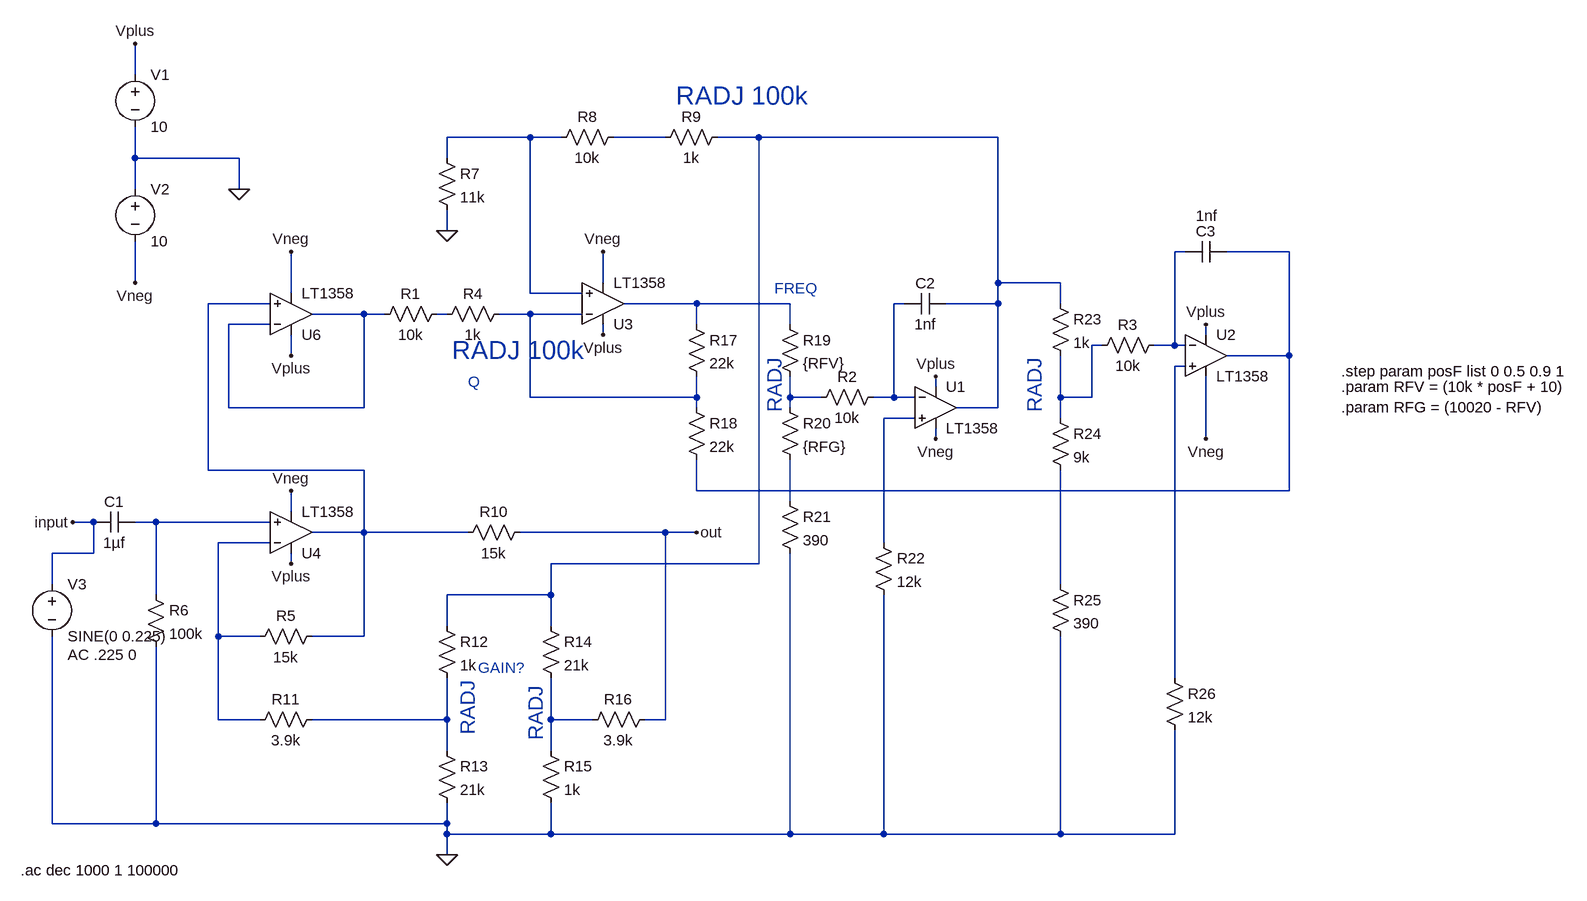
[diagram p0: schematic param_eq.asc]
param_eq.asc, the LTspice schematic file:
Version 4.1
SHEET 1 1232 680
WIRE -1104 -752 -1104 -800
WIRE -496 -656 -624 -656
WIRE -448 -656 -496 -656
WIRE -288 -656 -368 -656
WIRE -144 -656 -208 -656
WIRE 224 -656 -144 -656
WIRE -1104 -624 -1104 -672
WIRE -944 -624 -1104 -624
WIRE -624 -624 -624 -656
WIRE -1104 -576 -1104 -624
WIRE -944 -576 -944 -624
WIRE -624 -512 -624 -544
WIRE 512 -480 496 -480
WIRE 672 -480 576 -480
WIRE -1104 -432 -1104 -496
WIRE -384 -432 -384 -480
WIRE 224 -432 224 -656
WIRE 320 -432 224 -432
WIRE -864 -416 -864 -480
WIRE -496 -416 -496 -656
WIRE -416 -416 -496 -416
WIRE -896 -400 -992 -400
WIRE -240 -400 -352 -400
WIRE -96 -400 -240 -400
WIRE 80 -400 64 -400
WIRE 224 -400 224 -432
WIRE 224 -400 144 -400
WIRE 320 -400 320 -432
WIRE -752 -384 -832 -384
WIRE -720 -384 -752 -384
WIRE -624 -384 -640 -384
WIRE -496 -384 -544 -384
WIRE -416 -384 -496 -384
WIRE -896 -368 -960 -368
WIRE -240 -368 -240 -400
WIRE -96 -368 -96 -400
WIRE -384 -352 -384 -368
WIRE 544 -352 544 -368
WIRE 384 -336 368 -336
WIRE 496 -336 496 -480
WIRE 496 -336 464 -336
WIRE 512 -336 496 -336
WIRE -864 -320 -864 -352
WIRE 672 -320 672 -480
WIRE 672 -320 576 -320
WIRE 512 -304 496 -304
WIRE 128 -272 128 -288
WIRE -496 -256 -496 -384
WIRE -240 -256 -240 -288
WIRE -240 -256 -496 -256
WIRE -96 -256 -96 -288
WIRE -48 -256 -96 -256
WIRE 64 -256 64 -400
WIRE 64 -256 32 -256
WIRE 96 -256 64 -256
WIRE 320 -256 320 -320
WIRE 368 -256 368 -336
WIRE 368 -256 320 -256
WIRE -960 -240 -960 -368
WIRE -752 -240 -752 -384
WIRE -752 -240 -960 -240
WIRE -240 -240 -240 -256
WIRE -96 -240 -96 -256
WIRE 224 -240 224 -400
WIRE 224 -240 160 -240
WIRE 96 -224 48 -224
WIRE 320 -224 320 -256
WIRE 128 -192 128 -208
WIRE 544 -192 544 -288
WIRE -992 -144 -992 -400
WIRE -752 -144 -992 -144
WIRE -240 -112 -240 -160
WIRE 672 -112 672 -320
WIRE 672 -112 -240 -112
WIRE -96 -96 -96 -160
WIRE -864 -80 -864 -112
WIRE -1168 -64 -1200 -64
WIRE -1072 -64 -1104 -64
WIRE -896 -64 -1072 -64
WIRE -752 -48 -752 -144
WIRE -752 -48 -832 -48
WIRE -592 -48 -752 -48
WIRE -288 -48 -512 -48
WIRE -240 -48 -288 -48
WIRE -896 -32 -976 -32
WIRE 48 -32 48 -224
WIRE -1168 -16 -1168 -64
WIRE -1168 -16 -1232 -16
WIRE -864 0 -864 -16
WIRE -144 0 -144 -656
WIRE -144 0 -464 0
WIRE -1232 32 -1232 -16
WIRE 320 32 320 -144
WIRE -1072 48 -1072 -64
WIRE -464 48 -464 0
WIRE -464 48 -624 48
WIRE -624 96 -624 48
WIRE -464 96 -464 48
WIRE -976 112 -976 -32
WIRE -912 112 -976 112
WIRE -752 112 -752 -48
WIRE -752 112 -832 112
WIRE 496 176 496 -304
WIRE -976 240 -976 112
WIRE -912 240 -976 240
WIRE -624 240 -624 176
WIRE -624 240 -832 240
WIRE -464 240 -464 176
WIRE -400 240 -464 240
WIRE -288 240 -288 -48
WIRE -288 240 -320 240
WIRE -624 288 -624 240
WIRE -464 288 -464 240
WIRE -1232 400 -1232 112
WIRE -1072 400 -1072 128
WIRE -1072 400 -1232 400
WIRE -624 400 -624 368
WIRE -624 400 -1072 400
WIRE -624 416 -624 400
WIRE -464 416 -464 368
WIRE -464 416 -624 416
WIRE -96 416 -96 -16
WIRE -96 416 -464 416
WIRE 48 416 48 48
WIRE 48 416 -96 416
WIRE 320 416 320 112
WIRE 320 416 48 416
WIRE 496 416 496 256
WIRE 496 416 320 416
WIRE -624 448 -624 416
FLAG -624 448 0
FLAG -240 -48 out
FLAG -1200 -64 input
FLAG -624 -512 0
FLAG -864 -480 Vneg
FLAG -384 -480 Vneg
FLAG 128 -192 Vneg
FLAG 544 -192 Vneg
FLAG -864 -112 Vneg
FLAG -864 -320 Vplus
FLAG -384 -352 Vplus
FLAG 128 -288 Vplus
FLAG 544 -368 Vplus
FLAG -864 0 Vplus
FLAG -944 -576 0
FLAG -1104 -800 Vplus
FLAG -1104 -432 Vneg
SYMBOL Opamps\\LT1358 128 -304 R0
SYMATTR InstName U1
SYMBOL Opamps\\LT1358 544 -384 R0
SYMATTR InstName U2
SYMBOL Opamps\\LT1358 -384 -336 M180
SYMATTR InstName U3
SYMBOL Opamps\\LT1358 -864 16 M180
SYMATTR InstName U4
SYMBOL Opamps\\LT1358 -864 -320 M180
SYMATTR InstName U6
SYMBOL res -624 -400 R90
WINDOW 0 0 56 VBottom 2
WINDOW 3 32 56 VTop 2
SYMATTR InstName R1
SYMATTR Value 10k
SYMBOL res 480 -352 R90
WINDOW 0 0 56 VBottom 2
WINDOW 3 32 56 VTop 2
SYMATTR InstName R3
SYMATTR Value 10k
SYMBOL res -528 -400 R90
WINDOW 0 0 56 VBottom 2
WINDOW 3 32 56 VTop 2
SYMATTR InstName R4
SYMATTR Value 1k
SYMBOL res -816 96 R90
WINDOW 0 0 56 VBottom 2
WINDOW 3 32 56 VTop 2
SYMATTR InstName R5
SYMATTR Value 15k
SYMBOL res -1088 32 R0
SYMATTR InstName R6
SYMATTR Value 100k
SYMBOL cap -1104 -80 R90
WINDOW 0 0 32 VBottom 2
WINDOW 3 32 32 VTop 2
SYMATTR InstName C1
SYMATTR Value 1µf
SYMBOL res -640 -640 R0
SYMATTR InstName R7
SYMATTR Value 11k
SYMBOL res -352 -672 R90
WINDOW 0 0 56 VBottom 2
WINDOW 3 32 56 VTop 2
SYMATTR InstName R8
SYMATTR Value 10k
SYMBOL res -192 -672 R90
WINDOW 0 0 56 VBottom 2
WINDOW 3 32 56 VTop 2
SYMATTR InstName R9
SYMATTR Value 1k
SYMBOL res -496 -64 R90
WINDOW 0 0 56 VBottom 2
WINDOW 3 32 56 VTop 2
SYMATTR InstName R10
SYMATTR Value 15k
SYMBOL res -816 224 R90
WINDOW 0 0 56 VBottom 2
WINDOW 3 32 56 VTop 2
SYMATTR InstName R11
SYMATTR Value 3.9k
SYMBOL res -640 80 R0
SYMATTR InstName R12
SYMATTR Value 1k
SYMBOL res -640 272 R0
SYMATTR InstName R13
SYMATTR Value 21k
SYMBOL res -480 80 R0
SYMATTR InstName R14
SYMATTR Value 21k
SYMBOL res -480 272 R0
SYMATTR InstName R15
SYMATTR Value 1k
SYMBOL res -304 224 R90
WINDOW 0 0 56 VBottom 2
WINDOW 3 32 56 VTop 2
SYMATTR InstName R16
SYMATTR Value 3.9k
SYMBOL res -256 -384 R0
SYMATTR InstName R17
SYMATTR Value 22k
SYMBOL res -256 -256 R0
SYMATTR InstName R18
SYMATTR Value 22k
SYMBOL res -112 -384 R0
SYMATTR InstName R19
SYMATTR Value {RFV}
SYMBOL res -112 -256 R0
SYMATTR InstName R20
SYMATTR Value {RFG}
SYMBOL res -112 -112 R0
SYMATTR InstName R21
SYMATTR Value 390
SYMBOL res 32 -48 R0
SYMATTR InstName R22
SYMATTR Value 12k
SYMBOL res 48 -272 R90
WINDOW 0 0 56 VBottom 2
WINDOW 3 32 56 VTop 2
SYMATTR InstName R2
SYMATTR Value 10k
SYMBOL cap 144 -416 R90
WINDOW 0 0 32 VBottom 2
WINDOW 3 32 32 VTop 2
SYMATTR InstName C2
SYMATTR Value 1nf
SYMBOL res 304 -416 R0
SYMATTR InstName R23
SYMATTR Value 1k
SYMBOL res 304 -240 R0
SYMATTR InstName R24
SYMATTR Value 9k
SYMBOL res 304 16 R0
SYMATTR InstName R25
SYMATTR Value 390
SYMBOL cap 576 -496 R90
WINDOW 0 0 32 VBottom 2
WINDOW 3 -55 31 VTop 2
SYMATTR InstName C3
SYMATTR Value 1nf
SYMBOL res 480 160 R0
SYMATTR InstName R26
SYMATTR Value 12k
SYMBOL voltage -1104 -768 R0
WINDOW 123 0 0 Left 2
WINDOW 39 0 0 Left 2
SYMATTR InstName V1
SYMATTR Value 10
SYMBOL voltage -1104 -592 R0
WINDOW 123 0 0 Left 2
WINDOW 39 0 0 Left 2
SYMATTR InstName V2
SYMATTR Value 10
SYMBOL voltage -1232 16 R0
WINDOW 123 24 124 Left 2
WINDOW 39 0 0 Left 2
SYMATTR Value2 AC .225 0
SYMATTR InstName V3
SYMATTR Value SINE(0 0.225)
TEXT -616 -328 Left 4 ;RADJ 100k
TEXT -120 -232 VLeft 3 ;RADJ
TEXT 280 -232 VLeft 3 ;RADJ
TEXT -592 264 VLeft 3 ;RADJ
TEXT -488 272 VLeft 3 ;RADJ
TEXT -1280 472 Left 2 !.ac dec 1000 1 100000
TEXT -272 -720 Left 4 ;RADJ 100k
TEXT -576 160 Left 2 ;GAIN?
TEXT -592 -280 Left 2 ;Q
TEXT -120 -424 Left 2 ;FREQ
TEXT 752 -272 Left 2 !.param RFV = (10k * posF + 10)\n.param RFG = (10020 - RFV)
TEXT 752 -296 Left 2 !.step param posF list 0 0.5 0.9 1

The netlist it stands for:
* param_eq.asc
X§U1 N015 N008 Vplus Vneg N003 LT1357  ; LT1358, pins In+ In- V+ V- OUT
X§U2 N013 N004 Vplus Vneg N005 LT1357  ; LT1358, pins In+ In- V+ V- OUT
X§U3 N001 N011 Vplus Vneg N007 LT1357  ; LT1358, pins In+ In- V+ V- OUT
X§U4 N017 N018 Vplus Vneg N006 LT1357  ; LT1358, pins In+ In- V+ V- OUT
X§U6 N006 N009 Vplus Vneg N009 LT1357  ; LT1358, pins In+ In- V+ V- OUT
R1 N010 N009 10k
R3 N004 N012 10k
R4 N011 N010 1k
R5 N006 N018 15k
R6 N017 0 100k
C1 N017 input 1µf
R7 N001 0 11k
R8 N002 N001 10k
R9 N003 N002 1k
R10 out N006 15k
R11 N020 N018 3.9k
R12 N003 N020 1k
R13 N020 0 21k
R14 N003 N021 21k
R15 N021 0 1k
R16 out N021 3.9k
R17 N007 N011 22k
R18 N011 N005 22k
R19 N007 N014 {RFV}
R20 N014 N016 {RFG}
R21 N016 0 390
R22 N015 0 12k
R2 N008 N014 10k
C2 N003 N008 1nf
R23 N003 N012 1k
R24 N012 N019 9k
R25 N019 0 390
C3 N005 N004 1nf
R26 N013 0 12k
V1 Vplus 0 10
V2 0 Vneg 10
V3 input 0 SINE(0 0.225) AC .225 0
* RADJ 100k
* RADJ
* RADJ
* RADJ
* RADJ
.ac dec 1000 1 100000
* RADJ 100k
* GAIN?
* Q
* FREQ
.param RFV = (10k * posF + 10)
.param RFG = (10020 - RFV)
.step param posF list 0 0.5 0.9 1
.lib LTC.lib
.backanno
.end